# Altium project itanya_lata.PrjPcb
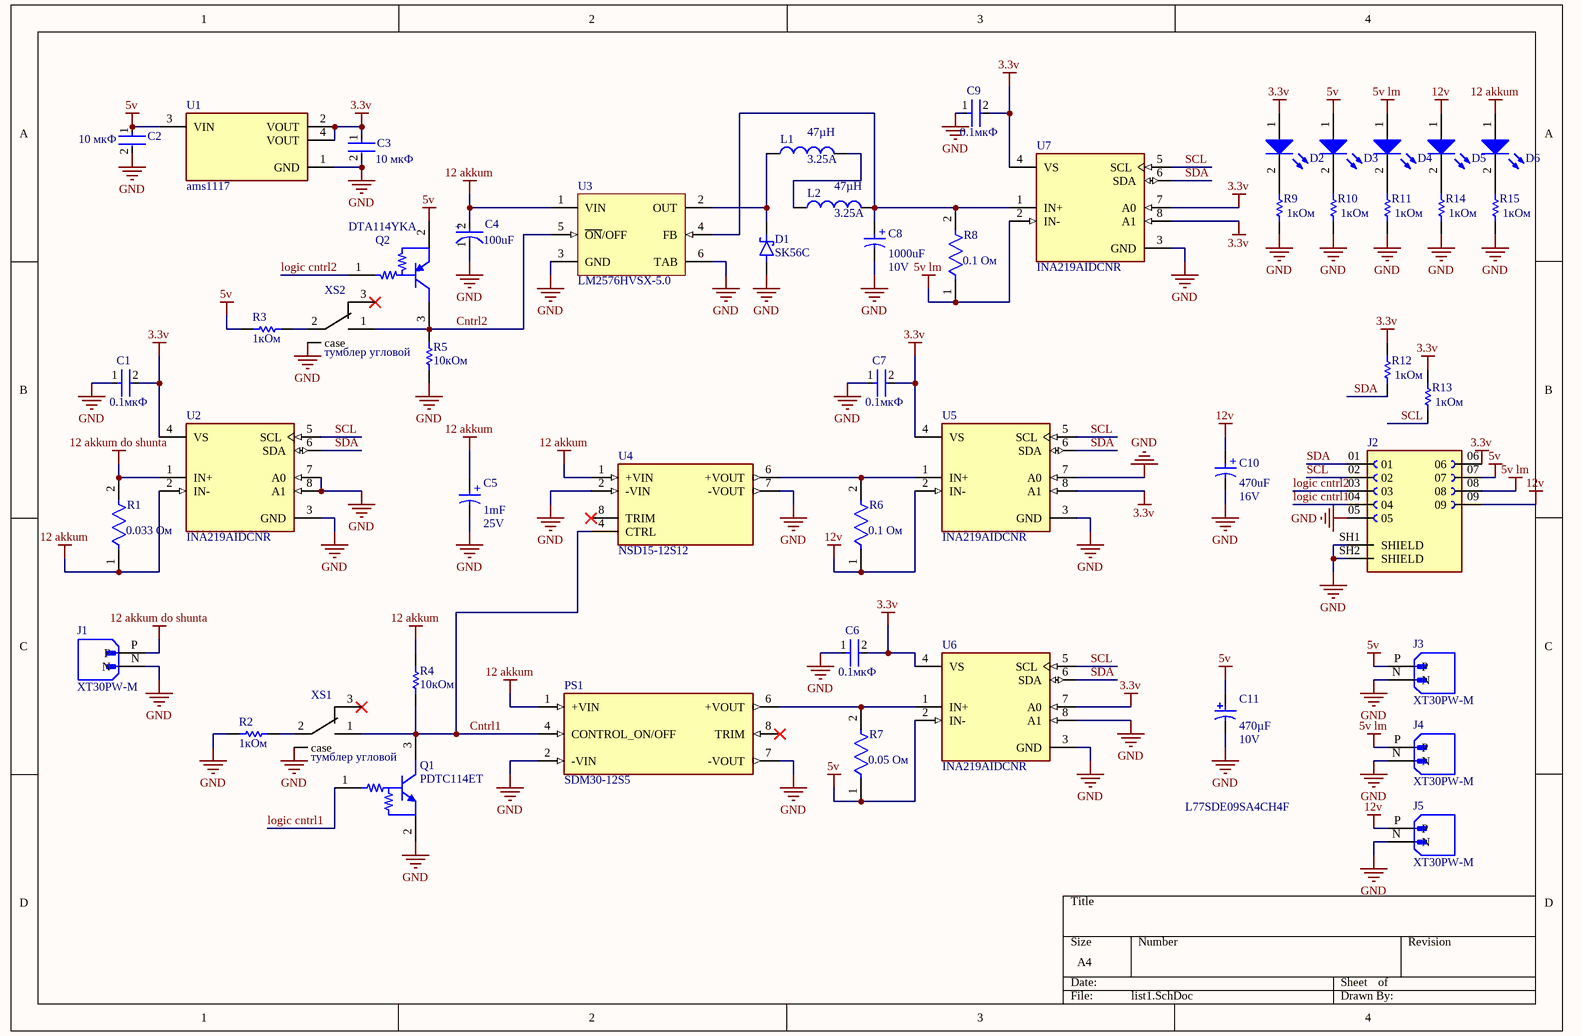
[diagram p0: list1.SchDoc]
2 sheets, 114 parts. Net scope: global (net labels, ports and power ports of the same name join across sheets).
Board files: platka.PcbDoc, PCB1.PcbDoc
Sheets:
  list1.SchDoc
  Main.SchDoc

## Sheet list1.SchDoc
size A4; SheetNumber: 1; SheetTotal: 2

### Parts
(Parts that share a designator on the sheet are numbered #1, #2 ... from top to bottom, then left to right.)
C1#1  value 0.1мкФ  [FP-C0805C-DN-IPC_A]  (hidden comment: C0805C104K5RACTU)
C2#1  value 10 мкФ  [FP-C0805C-DN-IPC_A]  (hidden comment: C0805C104K5RACTU)
C3#1  value 10 мкФ  [FP-C0805C-DN-IPC_A]  (hidden comment: C0805C104K5RACTU)
C4#1  Capacitance: 100uF  [FP-T495D107K016ATE125-MFG]  (hidden comment: T495D107K016ATE125)
C5#1  Voltage Rating: 25V  Capacitance: 1mF  [10*12.5]  (hidden comment: 865060257010)
C6#1  value 0.1мкФ  [FP-C0805C-DN-IPC_A]  (hidden comment: C0805C104K5RACTU)
C7#1  value 0.1мкФ  [FP-C0805C-DN-IPC_A]  (hidden comment: C0805C104K5RACTU)
C8  Voltage Rating: 10V  Capacitance: 1000uF  [WCAP-ASLL_D10H10.5]  (hidden comment: 865060257010)
C9  value 0.1мкФ  [FP-C0805C-DN-IPC_A]  (hidden comment: C0805C104K5RACTU)
C10  Voltage Rating: 16V  Capacitance: 470uF  [WCAP-ASLL_D10H10.5]  (hidden comment: 865060257010)
C11  Capacitance: 470µF  Rated Voltage: 10V  [PNSC-FK-V-F_V]  (hidden comment: EEEFK1C471P)
D1#1  SK56C  [DIOM6859X262N]
D2#1  Infrared, 1.5V, 30°  [WL-TIRC_3mm]  (value not drawn)
D3#1  Infrared, 1.5V, 30°  [WL-TIRC_3mm]  (value not drawn)
D4#1  Infrared, 1.5V, 30°  [WL-TIRC_3mm]  (value not drawn)
D5  Infrared, 1.5V, 30°  [WL-TIRC_3mm]  (value not drawn)
D6  Infrared, 1.5V, 30°  [WL-TIRC_3mm]  (value not drawn)
J1#1  XT30PW-M  [AMASS_XT30PW-M]
J2#1  L77SDE09SA4CH4F  [AMPHENOL_L77SDE09SA4CH4F]
J3  XT30PW-M  [AMASS_XT30PW-M]
J4  XT30PW-M  [AMASS_XT30PW-M]
J5  XT30PW-M  [AMASS_XT30PW-M]
L1  Current Rating: 3.25A  Inductance: 47µH  [SUMI-CDRH127_V]  (hidden comment: CDRH127/LDNP-470MC)
L2  Current Rating: 3.25A  Inductance: 47µH  [SUMI-CDRH127_V]  (hidden comment: CDRH127/LDNP-470MC)
PS1  SDM30-12S5  [CONV_SDM30-12S5]
Q1  PDTC114ET  [ONSC-SC-59-3-318D-04_V]
Q2  DTA114YKA  [ONSC-SOT-23-3-318-08_V]
R1#1  Resistance: 0.033 Ом  [FP-CRCW2512-e3-IPC_A]  (hidden comment: CRCW25121R00FKEG)
R2#1  Package Quantity: 1кОм  [RESC2013X70X40ML20T20]  (hidden comment: ERJ-6ENF1001V)
R3#1  Package Quantity: 1кОм  [RESC2013X70X40ML20T20]  (hidden comment: ERJ-6ENF1001V)
R4#1  Package Quantity: 10кОм  [RESC2013X70X40ML20T20]  (hidden comment: ERJ-6ENF1001V)
R5#1  Package Quantity: 10кОм  [RESC2013X70X40ML20T20]  (hidden comment: ERJ-6ENF1001V)
R6#1  Resistance: 0.1 Ом  [FP-CRCW2512-e3-IPC_A]  (hidden comment: CRCW25121R00FKEG)
R7#1  Resistance: 0.05 Ом  [FP-CRCW2512-e3-IPC_A]  (hidden comment: CRCW25121R00FKEG)
R8#1  Resistance: 0.1 Ом  [FP-CRCW2512-e3-IPC_A]  (hidden comment: CRCW25121R00FKEG)
R9#1  Package Quantity: 1кОм  [RESC2013X70X40ML20T20]  (hidden comment: ERJ-6ENF1001V)
R10#1  Package Quantity: 1кОм  [RESC2013X70X40ML20T20]  (hidden comment: ERJ-6ENF1001V)
R11#1  Package Quantity: 1кОм  [RESC2013X70X40ML20T20]  (hidden comment: ERJ-6ENF1001V)
R12#1  Package Quantity: 1кОм  [RESC2013X70X40ML20T20]  (hidden comment: ERJ-6ENF1001V)
R13#1  Package Quantity: 1кОм  [RESC2013X70X40ML20T20]  (hidden comment: ERJ-6ENF1001V)
R14#1  Package Quantity: 1кОм  [RESC2013X70X40ML20T20]  (hidden comment: ERJ-6ENF1001V)
R15#1  Package Quantity: 1кОм  [RESC2013X70X40ML20T20]  (hidden comment: ERJ-6ENF1001V)
U1#1  ams1117  [FP-ams1117-IPC_A]
U2#1  INA219AIDCNR  [FP-DCN0008A-IPC_C]
U3#1  LM2576HVSX-5.0  [KTT0005B_M]
U4#1  NSD15-12S12  [CONV_NSD15-12S5]
U5#1  INA219AIDCNR  [FP-DCN0008A-IPC_C]
U6  INA219AIDCNR  [FP-DCN0008A-IPC_C]
U7  INA219AIDCNR  [FP-DCN0008A-IPC_C]
XS1  тумблер угловой  [тумблер угловой]
XS2  тумблер угловой  [тумблер угловой]

### Nets
3.3v: C1#1.2 C3#1.1 C6#1.2 C7#1.2 C9.2 D2#1.1(A) J2#1.06 R12#1.2 R13#1.2 U1#1.2(VOUT) U1#1.4(VOUT) U2#1.4(VS) U5#1.4(VS) U5#1.8(A1) U6.4(VS) U6.7(A0) U7.4(VS) U7.7(A0) U7.8(A1)
5v: C2#1.1 C11.1 D3#1.1(A) J2#1.07 J3.P Q2.2(E) R3#1.2 R7#1.1 U1#1.3(VIN) U6.2(IN-)
5v lm: D4#1.1(A) J2#1.08 J4.P R8#1.1 U7.2(IN-)
12 akkum: C4#1.2(A) C5#1.1(P) D6.1(A) PS1.1(+VIN) R1#1.1 R4#1.1 U2#1.2(IN-) U3#1.1(VIN) U4#1.1(+VIN)
12 akkum do shunta: J1#1.P R1#1.2 U2#1.1(IN+)
12v: C10.1(P) D5.1(A) J2#1.09 J5.P R6#1.1 U5#1.2(IN-)
GND: C1#1.1 C2#1.2 C3#1.2 C4#1.1(C) C5#1.2(N) C6#1.1 C7#1.1 C8.2(N) C9.1 C10.2(N) C11.2 D1#1.A J1#1.N J2#1.05 J2#1.SH1(SHIELD) J2#1.SH2(SHIELD) J3.N J4.N J5.N PS1.2(-VIN) PS1.7(-VOUT) Q1.2(E) R2#1.2 R5#1.1 R9#1.1 R10#1.1 R11#1.1 R14#1.1 R15#1.1 U1#1.1(GND) U2#1.3(GND) U2#1.7(A0) U2#1.8(A1) U3#1.3(GND) U3#1.6(TAB) U4#1.2(-VIN) U4#1.7(-VOUT) U5#1.3(GND) U5#1.7(A0) U6.3(GND) U6.8(A1) U7.3(GND) XS1.0(case) XS2.0(case)
Cntrl1: PS1.4(CONTROL_ON/OFF) Q1.3(C) R4#1.2 U4#1.4(CTRL) XS1.1
Cntrl2: Q2.3(C) R5#1.2 U3#1.5(~{ON}/OFF) XS2.1
logic cntrl1: J2#1.04 Q1.1(B)
logic cntrl2: J2#1.03 Q2.1(B)
SCL: J2#1.02 R13#1.1 U2#1.5(SCL) U5#1.5(SCL) U6.5(SCL) U7.5(SCL)
SDA: J2#1.01 R12#1.1 U2#1.6(SDA) U5#1.6(SDA) U6.6(SDA) U7.6(SDA)
NetC8_1: C8.1(P) L2.2 R8#1.2 U3#1.4(FB) U7.1(IN+)
NetD1#1_C: D1#1.C(K) L1.1 U3#1.2(OUT)
NetD2#1_2: D2#1.2(K) R9#1.2
NetD3#1_2: D3#1.2(K) R10#1.2
NetD4#1_2: D4#1.2(K) R11#1.2
NetD5_2: D5.2(K) R14#1.2
NetD6_2: D6.2(K) R15#1.2
NetL1_2: L1.2 L2.1
NetPS1_6: PS1.6(+VOUT) R7#1.2 U6.1(IN+)
NetR2#1_1: R2#1.1 XS1.2
NetR3#1_1: R3#1.1 XS2.2
NetR6#1_2: R6#1.2 U4#1.6(+VOUT) U5#1.1(IN+)

Not connected (* = marked no-connect by the designer): PS1 8(TRIM)*; U4#1 8(TRIM)*; XS1 3*; XS2 3*

### Notes on the sheet
- (in symbol CMP-2000-07207-2) +
- (in symbol CMP-03913-54202466-2) +
- (in symbol konder) +

### Library data of the parts
C1#1 C6#1 C7#1 C9 = CMP-2007-00279-2: CAP CER 0.1UF 50V X7R 0805; Manufacturer: KEMET; Tolerance: 0.1; Temperature Coefficient: 30ppm/°C; Material: Ceramic; Capacitance: 0.10 μF; Manufacturer Part Number: C0805C104K5RACTU; Device Class L2: Capacitors; Temperature Range Low: -55°C; Voltage Rating: 50 V; Digikey Description: CAP CER 0.1UF 50V X7R 0805; Category: Cap; ComponentLink2Description: Datasheet; Octopart: https://octopart.com/c0805c104k5ractu-kemet-143926; RoHS: TRUE; ComponentLink2URL: https://content.kemet.com/datasheets/KEM_C1003_C0G_SMD.pdf; Temperature Characteristic: X7R; Temperature: -55°C to +125°C; Height: 0.88mm; Temperature Range High: +125°C; Device Class L1: Passive Components; Automotive: No; Lead Free: Yes; Ipc Land Pattern Name: CAPC200125X78; Device Class L3: Ceramic Capacitors; Mouser Description: Cap Ceramic 0.1uF 50V X7R 10% SMD 2.0 x 1.2 mm 125 C Paper T/R; Package: C0805C-DN
C2#1 C3#1 = CMP-2007-00279-2: CAP CER 10UF 50V X7R 0805; Manufacturer: KEMET; Tolerance: 0.1; Temperature Coefficient: 30ppm/°C; Material: Ceramic; Capacitance: 0.10 μF; Manufacturer Part Number: C0805C104K5RACTU; Device Class L2: Capacitors; Temperature Range Low: -55°C; Voltage Rating: 50 V; Digikey Description: CAP CER 0.1UF 50V X7R 0805; Category: Cap; ComponentLink2Description: Datasheet; Octopart: https://octopart.com/c0805c104k5ractu-kemet-143926; RoHS: TRUE; ComponentLink2URL: https://content.kemet.com/datasheets/KEM_C1003_C0G_SMD.pdf; Temperature Characteristic: X7R; Temperature: -55°C to +125°C; Height: 0.88mm; Temperature Range High: +125°C; Device Class L1: Passive Components; Automotive: No; Lead Free: Yes; Ipc Land Pattern Name: CAPC200125X78; Device Class L3: Ceramic Capacitors; Mouser Description: Cap Ceramic 0.1uF 50V X7R 10% SMD 2.0 x 1.2 mm 125 C Paper T/R; Package: C0805C-DN
C4#1 = CMP-2000-07207-2: CAP TANT 100UF 10% 16V 2917; Life (Hours): 2000Hour; ESR (Equivalent Series Resistance): 125mR; Polarity: Polar; Dielectric Material: Tantalum; Dissipation Factor: 8%; Radiation Hardening: No; RoHS Compliant: Yes; Length: 7.3mm; Features: General Purpose; Packaging: Tape and Reel; Package Quantity: 1; Weight: 0.023634oz; Voltage Rating: 16V; Width: 0.169inch; Case/Package: 2917; Mount: Surface Mount; Voltage: 16V; Min Operating Temperature: -55°C; Tolerance: 10%; REACH SVHC: No SVHC; Height - Seated (Max): 0.122inch; Number of Pins: 2; Construction: Flat; Depth: 4.3mm; Series: T495; Max Operating Temperature: 125°C; Failure Rate: 0.001%; Termination: SMD/SMT; Voltage Rating (DC): 16V; Case Code (Imperial): 2917; Case Code (Metric): 7343; Height: 2.8mm
C5#1 = konder: 865060257010 WCAP-ASLL Aluminum Electrolytic Capacitors 1000uf 25V; NexarPartId: 54202466; ESR (Equivalent Series Resistance): 99.9268mΩ; Insulation Resistance: 100kΩ; Voltage Rating (DC): 10V; Life (Hours): 5000hours; Ripple Current: 690mA; Impedance: 90mΩ; Polarity: Polar; Leakage Current: 100µA; Tolerance: 20%; Diameter: 10mm; Min Operating Temperature: -55°C; Max Operating Temperature: 105°C; Length: 12.5mm; Height: 10.5mm; Height - Seated (Max): 10.4902mm; Mount: Surface Mount; Case/Package: Radial; REACH SVHC: Unknown; Ripple Current (AC): 690mA; RoHS: Compliant
C8 = CMP-03913-54202466-2: 865060257010 WCAP-ASLL Aluminum Electrolytic Capacitors 1000uf 10v; ESR (Equivalent Series Resistance): 99.9268mΩ; Insulation Resistance: 100kΩ; Life (Hours): 5000hours; Ripple Current: 690mA; Impedance: 90mΩ; Polarity: Polar; Leakage Current: 100µA; Tolerance: 20%; Diameter: 10mm; Min Operating Temperature: -55°C; Max Operating Temperature: 105°C; Length: 10.5mm; Voltage Rating (DC): 10V; Height: 10.5mm; Height - Seated (Max): 10.4902mm; Mount: Surface Mount; Case/Package: Radial; REACH SVHC: Unknown; NexarPartId: 54202466; Ripple Current (AC): 690mA; RoHS: Compliant
C10 = CMP-03913-54202466-2: 865060257010 WCAP-ASLL Aluminum Electrolytic Capacitors 470uf 16v; ESR (Equivalent Series Resistance): 99.9268mΩ; Insulation Resistance: 100kΩ; Voltage Rating (DC): 10V; Life (Hours): 5000hours; Ripple Current: 690mA; Impedance: 90mΩ; Polarity: Polar; Leakage Current: 100µA; Tolerance: 20%; Diameter: 10mm; Min Operating Temperature: -55°C; Max Operating Temperature: 105°C; Length: 10.5mm; Height: 10.5mm; Height - Seated (Max): 10.4902mm; Mount: Surface Mount; Case/Package: Radial; REACH SVHC: Unknown; NexarPartId: 54202466; Ripple Current (AC): 690mA; RoHS: Compliant
C11 = CMP-2000-06204-1: Aluminum Electrolytic Capacitor, 470 uF, +/- 20%, 10 V, 2-Pin SMD (Size Code F), -55 to 105 degC, RoHS, Tape and Reel; Manufacturer: Panasonic; Type: Can; Ripple Current: 600mA; Lifetime@Temperature: 2000Hrs@105°C; Impedance: 0.16O; Manufacturer URL: http://www.panasonic.com/; Package Description: 2-Pin Electrolytic Aluminum Capacitor, Body 8.3 x 8.3 mm; Operating Temp-Max: 105°C; Mounting Technology: SurfaceMount; Operating Temp Range: -55to+105°C; Datasheet Version: 03/2016; Series: FK; Package Reference: FK-V-F; Case Size/Dimension: Ø8x10.2mm; Package URL: http://industrial.panasonic.com/cdbs/www-data/pdf/RDE0000/DME0000COL48.pdf; Datasheet URL: http://industrial.panasonic.com/cdbs/www-data/pdf/RDE0000/ABA0000C1181.pdf
D1#1 = SK56C: 5A, 60V, Schottky Rectifier; MF: Taiwan Semiconductor; Purchase-URL: https://pricing.snapeda.com/search/part/SK56C/?ref=eda; Package: SMC-2 Taiwan Semiconductor; Availability: In Stock; Value: *; MP: SK56C; Check_prices: https://www.snapeda.com/parts/SK56C/Taiwan+Semiconductor/view-part/?ref=eda; Price: None; SnapEDA_Link: https://www.snapeda.com/parts/SK56C/Taiwan+Semiconductor/view-part/?ref=snap
D2#1 D3#1 D4#1 D5 D6 = 15400385F3590: WL-TIRC THT Infrared Round Waterclear, 3mm, 60mW/sr, Infrared, 1.5V, 30°; Manufacturer: Wurth Elektronik; Centroid Wavelength: 845nm; Chip Technology: AlGaAs; Manufacturer Part Number: 15400385F3590; Category: Infrared LEDs; Match Code: WL-TIRC; ComponentLink1Description: Website Link; ComponentLink1URL: https://www.we-online.com/redexpert/article/15400385F3590?ad; ComponentLink2Description: Datasheet Link; ComponentLink2URL: https://www.we-online.com/redexpert/spec/15400385F3590?ad; Mount: Through Hole; Operating Temperature Max: 85°C; Operating Temperature Min: -40°C; Packaging: Bulk; Height: 5.3mm; Diameter: 3.85mm; Emitting Color: Infrared; Forward Voltage: 1.5V; Radiant Intensity: 60mW/sr; Viewing Angle: 30°
J1#1 J3-J5 = XT30PW-M: Socket; DC supply; XT30; male; PIN: 2; on PCBs; THT; Colour: yellow; MF: AMASS; SnapEDA_Link: https://www.snapeda.com/parts/XT30PW-M/AMASS/view-part/?ref=snap; Package: None; Value: *; MP: XT30PW-M; Check_prices: https://www.snapeda.com/parts/XT30PW-M/AMASS/view-part/?ref=eda
J2#1 = L77SDE09SA4CH4F: Connector d-sub rt angle pcb recept 4-40 threaded hole w/screwlock 9 socket cont | Amphenol Commercial (Amphenol CS) L77SDE09SA4CH4F; MF: Amphenol ICC (Commercial Products); SnapEDA_Link: https://www.snapeda.com/parts/L77SDE09SA4CH4F/Amphenol/view-part/?ref=snap; Package: None; Value: *; MP: L77SDE09SA4CH4F; Check_prices: https://www.snapeda.com/parts/L77SDE09SA4CH4F/Amphenol/view-part/?ref=eda
L1 L2 = CMP-2000-06084-1: Power Inductor, 10 uH, +/- 20%, -40 to 100 degC, 2-Pin SMD, RoHS, Tape and Reel; Manufacturer: Sumida; Catalog Drawings: CDRH127SeriesFrontCDRH127SeriesSideCDRH127SeriesBottom; Product Training Modules: PowerInductorBasics; Shielding: Shielded; Online Catalog: CDRHSeries; DC Resistance (DCR): 21.6mOhmMax; Other Names: 308-1457-1; Frequency - Test: 1kHz; Mounting Type: SurfaceMount; Datasheet Version: 01/2014; Package Description: 2-Pin Surface Mount Device, Body 12 x 12 mm; Frequency - Self Resonant: -; Package Reference: CDRH127; Category: Inductors,Coils,Chokes; Material - Core: -; Q @ Freq: -; Type: -; Family: FixedInductors; Ratings: -; Series: CDRH127; Manufacturer URL: http://www.sumida.com/; Operating Temperature: -40°C~100°C; Height - Seated (Max): 0.315"(8.00mm); Standard Package: 1; Size / Dimension: 0.472"Lx0.472"W(12.00mmx12.00mm); Current - Saturation: -; Datasheet URL: http://products.sumida.com/products/pdf/CDRH127.pdf; Package / Case: Nonstandard; Tolerance: ±20%; Mounting Technology: SurfaceMount; Packaging: CutTape(CT)
PS1 = SDM30-12S5: Isolated Module DC DC Converter 1 Output 5V 5A 9.2V - 18V Input; MF: MEAN WELL; Value: *; SnapEDA_Link: https://www.snapeda.com/parts/SDM30-12S5/MEAN%20WELL%20USA%20Inc./view-part/9848/?ref=snap; MP: SDM30-12S5; Check_prices: https://www.snapeda.com/parts/SDM30-12S5/MEAN%20WELL%20USA%20Inc./view-part/9848/?ref=eda; Package: DIP-8 Mean Well; Digi-Key_Part_Number: 1866-4448-ND; Purchase-URL: https://pricing.snapeda.com/search/part/SDM30-12S5/?ref=eda
Q1 = CMP-0630-00125-1: Digital Transistor (BRT), R1=47 kOhm, R2=47 kOhm, NPN Transistor, 3-Pin SC-59, Pb-Free, Tape and Reel пох какой цифровой транзюк; Manufacturer: On Semiconductor; PartNumber: MUN2213T1G; V(BR)CEO Min (V): 50; IC Continuous (A): 0.1; R1/R2 Typ: 1; hFE Min: 80; ComponentLink1URL: http://www.onsemi.com/; ComponentLink3URL: http://www.onsemi.cn/pub_link/Collateral/318D-04.PDF; ComponentLink2Description: Datasheet; RoHS: TRUE; Mounting Technology: Surface Mount; PackageReference: SC-59-3-318D-04; PackageVersion: Rev. H, 06/2012; DatasheetVersion: Rev. 2; Polarity: NPN; ComponentLink2URL: http://www.onsemi.cn/pub_link/Collateral/DTC144E-D.PDF; ComponentLink1Description: Manufacturer URL; Packing: Tape and Reel; PackageDescription: 3-Pin Small Outline Transistor, Body 2.9 x 1.5 mm, Pitch 0.95 mm; ComponentLink3Description: Package Specification
Q2 = CMP-0630-00280-1: Digital Transistor (BRT), R1=4.7 kOhm, R2=infinity kOhm, PNP Transistor, 3-Pin SOT-23, Pb-Free, Tape and Reel; PartNumber: SMMUN2116LT3G; Manufacturer: On Semiconductor; hFE Min: 160; IC Continuous (A): 0.1; V(BR)CEO Min (V): 50; ComponentLink3Description: Package Specification; PackageDescription: 3-Pin Small Outline Transistor, Body 2.92 x 1.3 mm, Pitch 0.95 mm; PackageReference: SOT-23-3-318-08; ComponentLink1URL: http://www.onsemi.com/; ComponentLink3URL: http://www.onsemi.cn/pub_link/Collateral/318-08.PDF; Polarity: PNP; Packing: Tape and Reel; RoHS: TRUE; DatasheetVersion: Rev. 2; Mounting Technology: Surface Mount; ComponentLink2URL: http://www.onsemi.cn/pub_link/Collateral/DTA143T-D.PDF; PackageVersion: Rev. AP, 11/2009; ComponentLink2Description: Datasheet; ComponentLink1Description: Manufacturer URL
R1#1 R6#1 R7#1 R8#1 = CMP-02407-006956-1: RES Thick Film, 1Ω, 1%, 1W, 100ppm/°C, 2512; Voltage Rating: 500V; Number of Terminations: 2; Packaging: Tape and Reel; Features: Automotive AEC-Q200; Military Standard: Not; Power Rating: 1W; Max Operating Temperature: 155°C; Number of Pins: 2; Radiation Hardening: No; Mount: Surface Mount; Height: 0.6mm; Max Power Dissipation: 1W; Case Code (Metric): 6432; Termination: SMD/SMT; REACH SVHC: No SVHC; Case/Package: 2512; Weight: 0.001429oz; Tolerance: 1%; Package Quantity: 2000; Composition: Thick Film; Temperature Coefficient: 100ppm/°C; Voltage Rating (DC): 500V; Width: 0.124inch; Length: 6.3mm; Lead Free: Lead Free; Min Operating Temperature: -55°C; Contact Plating: Tin; Case Code (Imperial): 2512; Depth: 3.15mm
R2#1 R3#1 R4#1 R5#1 R9#1 R10#1 R11#1 R12#1 R13#1 R14#1 R15#1 = CMP-2001-04375-5: Chip Resistor, 1 KOhm, +/- 1%, 0.125 W, -55 to 155 degC, 0805 (2012 Metric), RoHS, Tape and Reel; Manufacturer: Panasonic; Voltage Rating: 150 V; ComponentLink1URL: http://www.panasonic.com/; ComponentLink2Description: Datasheet; REACH SVHC: Yes; ComponentLink1Description: Manufacturer URL; Length: 2 mm; Height: 0.6 mm; PackageDescription: 2-Pin Surface Mount Device, Body 2 x 1.25 mm; Packaging: Cut Tape; PackageReference: 0805; Max Operating Temperature: 155 degC; Mounting Technology: Surface Mount; ComponentLink2URL: http://industrial.panasonic.com/cdbs/www-data/pdf/RDA0000/AOA0000C86.pdf; DatasheetVersion: 04/2015; Min Operating Temperature: -55 degC; RoHSCompliant: true; Mount: Surface Mount
U1#1 = CMP-209535-000002-1: 1A LOW DROPOUT VOLTAGE REGULATOR 3.3V; RoHS Compliant: Yes
U2#1 U5#1 U6 U7 = CMP-0704-00041-3: IC CURRENT MONITOR 1% SOT23-8; Common Mode Rejection Ratio: 100dB; Bandwidth: 3.4MHz; Operating Supply Current: 1mA; Nominal Supply Current: 700uA; Min Input Voltage: 0V; Output Current per Channel: 10mA; Number of Amplifiers: 1; Input Offset Voltage (Vos): 100uV; Max Input Voltage: 26V; Min Supply Voltage: 3V; Max Supply Current: 5mA; Max Supply Voltage: 5.5V; Output Type: Digital; Accuracy: 1%; Radiation Hardening: No; Min Operating Temperature: -40°C; Contact Plating: Gold; REACH SVHC: No SVHC; Packaging: Tape and Reel; Max Operating Temperature: 125°C; Lead Free: Lead Free; Weight: 0.001411oz; Supply Current: 700uA; Number of Pins: 8; Length: 3mm; Quiescent Current: 700uA; Features: I²C; Height: 1.3mm; Output Current: 10mA; Case/Package: SOT-23-8; RoHS Compliant: Yes; Width: 1.75mm; Package Quantity: 3000; Series: Zero-Drift
U3#1 = CMP-0069-00141-3: SIMPLE SWITCHER® 3A Step-Down Voltage Regulator, 5-pin TO-263; Manufacturer: Texas Instruments; PackageTopMarking: NSUZXYTTE#*LM2576*HVS-5.0 P+; PowerWise: N; RoHS: N; PackageDescription: TO-263, Molded, .400 x .390 x .180in, 5 Lead, .067in Pitch, Surface Mount; Code_JEDEC: MO-169-AB; CompType: Switcher; ComponentLink1URL: http://www.ti.com/general/docs/lit/getliterature.tsp?genericPartNumber=LM2576HV&fileType=pdf; ComponentLink1Description: Datasheet URL; PinCount: 5; PackageReference: KTT0005B
U4#1 = NSD15-12S12: Isolated Module DC DC Converter 1 Output 5V 3A 9.4V - 36V Input; MP: NSD15-12S5; MF: MEAN WELL; SnapEDA_Link: https://www.snapeda.com/parts/NSD15-12S5/MEAN%20WELL%20USA%20Inc./view-part/356097/?ref=snap; Value: *; Package: DIP-8 Mean Well; Digi-Key_Part_Number: 1866-3633-ND
XS1 XS2 = тумблер угловой: SMTS-102-2C4

## Sheet Main.SchDoc
size A2; SheetNumber: 2; SheetTotal: 2
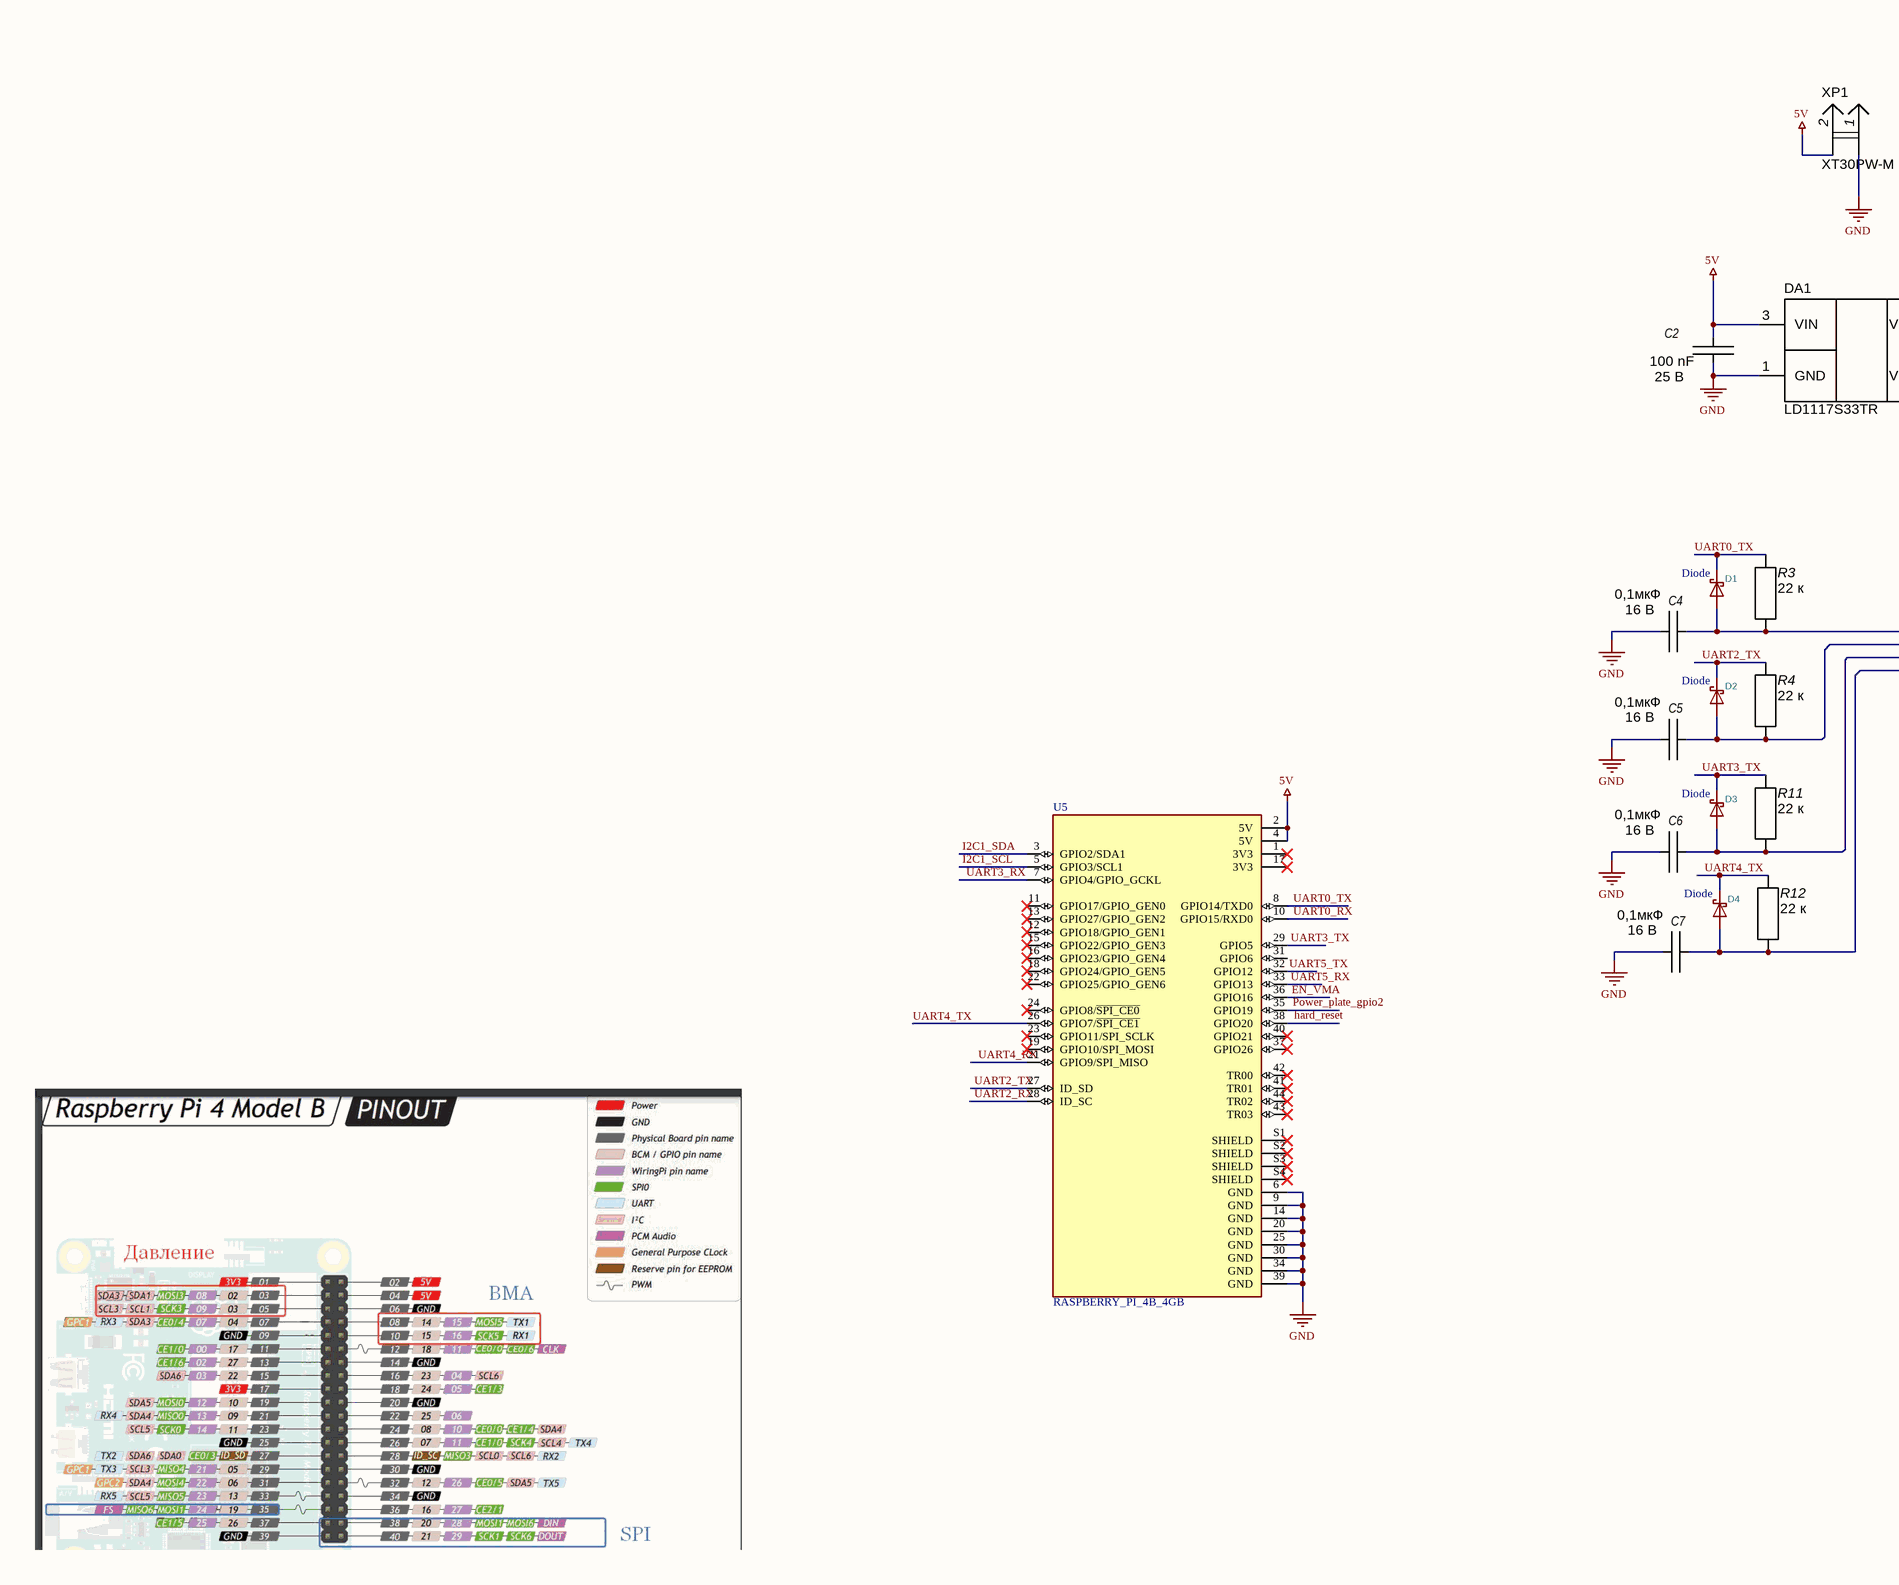
[diagram p1: Main.SchDoc, left]
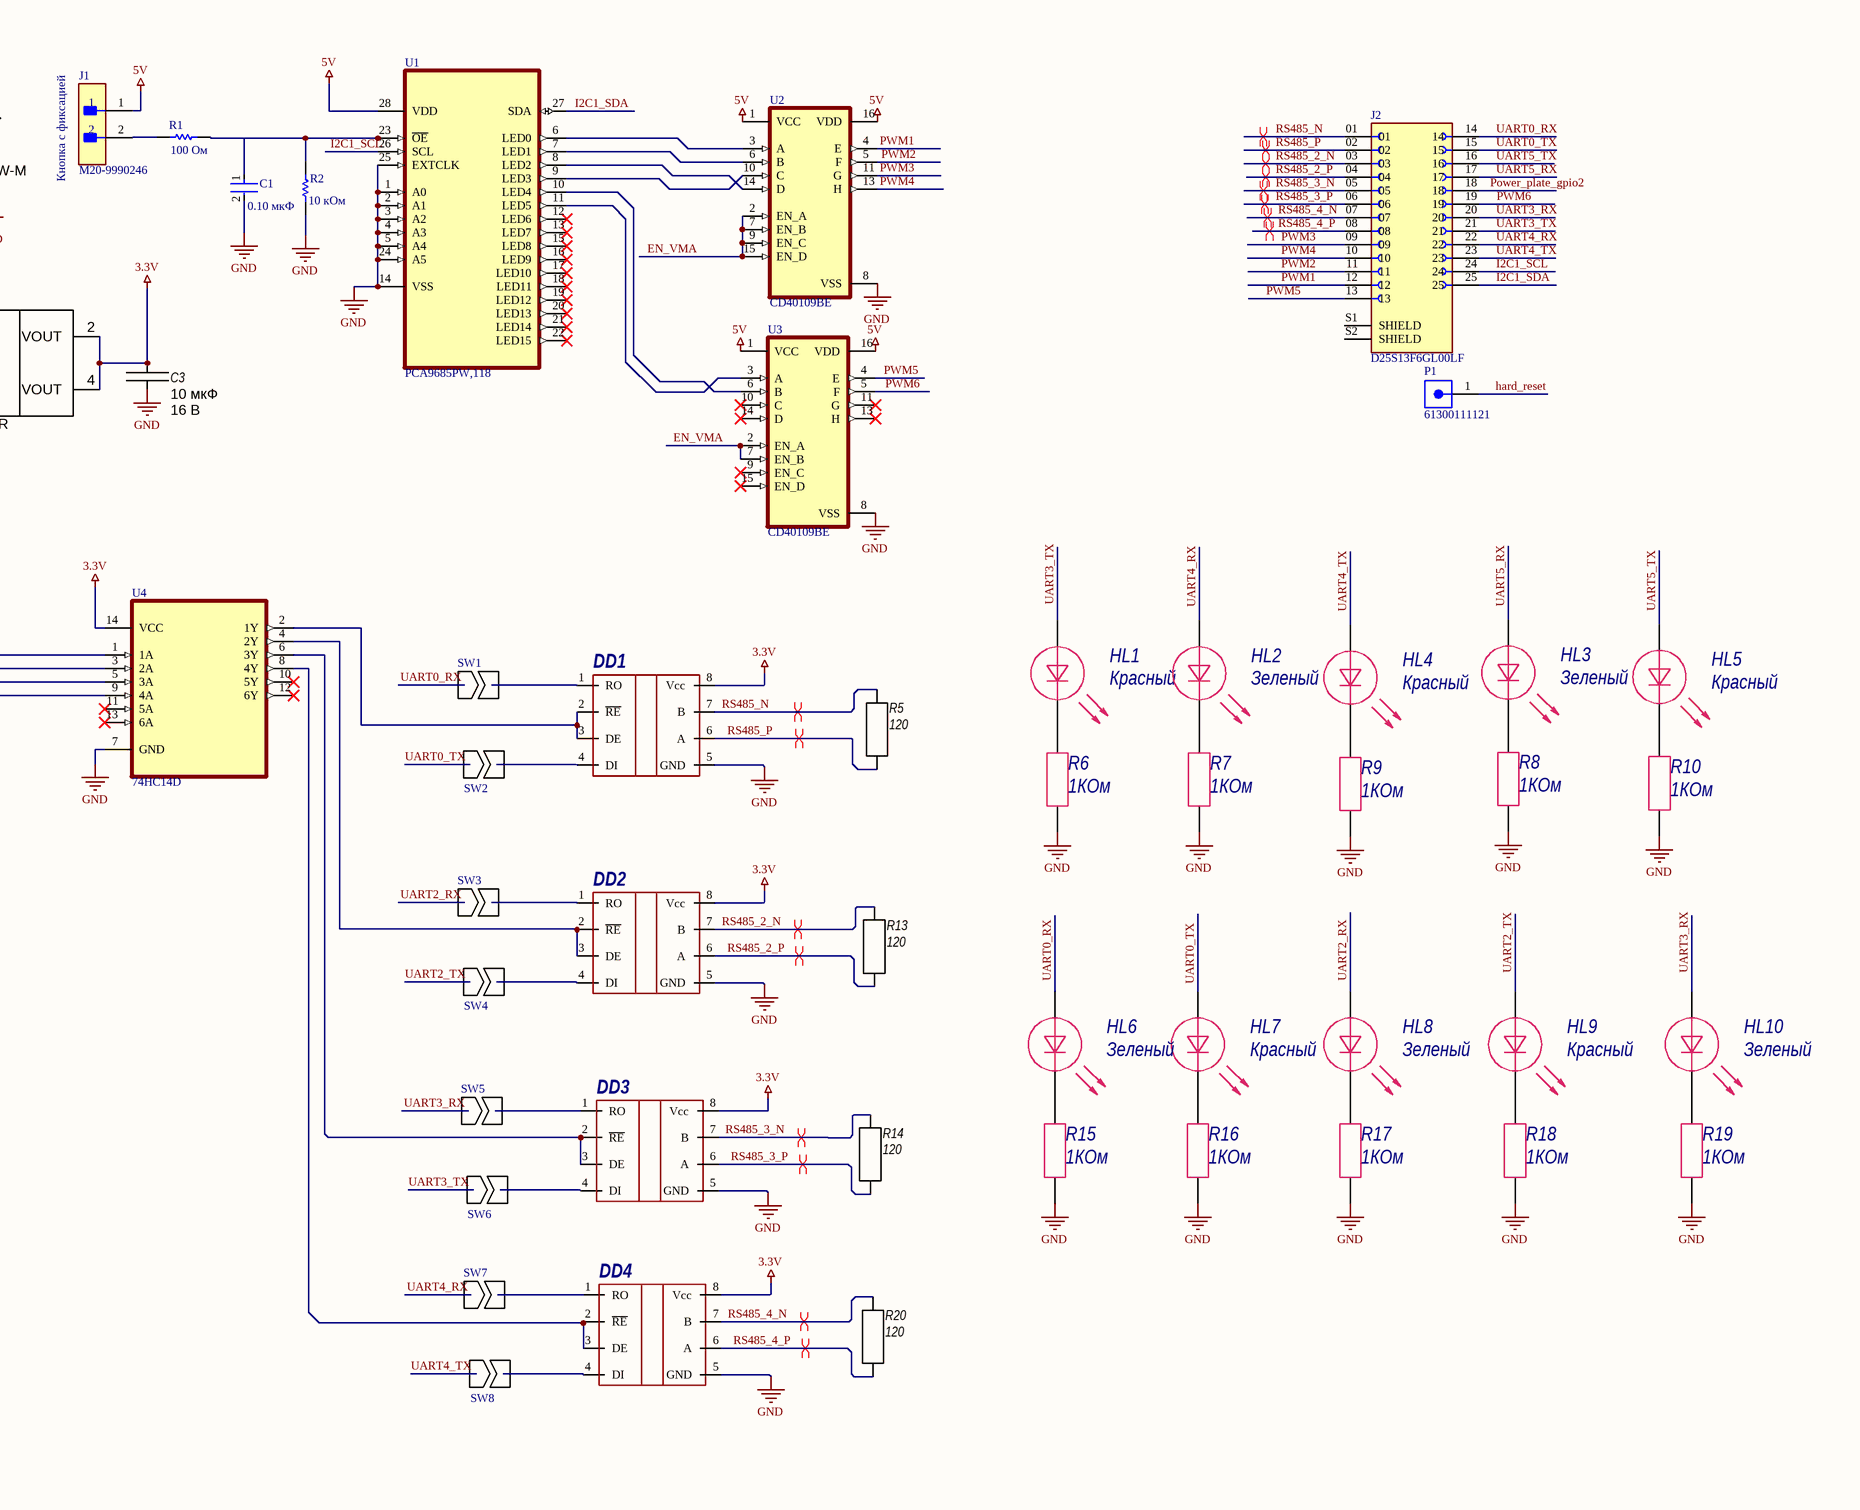
[diagram p2: Main.SchDoc, right]

### Parts
(Parts that share a designator on the sheet are numbered #1, #2 ... from top to bottom, then left to right.)
C1#2  value 0.10 мкФ  [FP-C0805C-DN-IPC_A]  (hidden comment: C0805C104K5RACTU)
C2#2  Voltage: 25 В  [C0402C]  (hidden comment: 100 nF)
C3#2  Voltage: 16 В  [C0805C]  (hidden comment: 10 мкФ)
C4#2  Voltage: 16 В  [C0603C]  (hidden comment: 0,1мкФ)
C5#2  Voltage: 16 В  [C0603C]  (hidden comment: 0,1мкФ)
C6#2  Voltage: 16 В  [C0603C]  (hidden comment: 0,1мкФ)
C7#2  Voltage: 16 В  [C0603C]  (hidden comment: 0,1мкФ)
D1#2  Diode  [SOD-123F]
D2#2  Diode  [SOD-123F]
D3#2  Diode  [SOD-123F]
D4#2  Diode  [SOD-123F]
DA1  LD1117S33TR  [SOT-223]
DD1  (no value)  [SOIC8N]
DD2  (no value)  [SOIC8N]
DD3  (no value)  [SOIC8N]
DD4  (no value)  [SOIC8N]
HL1  Color: Красный  [0805D]
HL2  Color: Зеленый  [0805D]
HL3  Color: Зеленый  [0805D]
HL4  Color: Красный  [0805D]
HL5  Color: Красный  [0805D]
HL6  Color: Зеленый  [0805D]
HL7  Color: Красный  [0805D]
HL8  Color: Зеленый  [0805D]
HL9  Color: Красный  [0805D]
HL10  Color: Зеленый  [0805D]
J1#2  M20-9990246  [FP-M20-9990246-MFG]
J2#2  D25S13F6GL00LF  [AMPHENOL_D25S13F6GL00LF]
P1  61300111121  [61300111121]
R1#2  value 100 Ом  [RESC2013X70X40ML20T20]  (hidden comment: ERJ-6ENF1001V)
R2#2  value 10 кОм  [RESC2013X70X40ML20T20]  (hidden comment: ERJ-6ENF1001V)
R3#2  22 к  [C0603R]
R4#2  22 к  [C0603R]
R5#2  120  [C0603R]
R6#2  value 1КОм  [0603R]  (hidden comment: Resistor)
R7#2  value 1КОм  [0603R]  (hidden comment: Resistor)
R8#2  value 1КОм  [0603R]  (hidden comment: Resistor)
R9#2  value 1КОм  [0603R]  (hidden comment: Resistor)
R10#2  value 1КОм  [0603R]  (hidden comment: Resistor)
R11#2  22 к  [C0603R]
R12#2  22 к  [C0603R]
R13#2  120  [C0603R]
R14#2  120  [C0603R]
R15#2  value 1КОм  [0603R]  (hidden comment: Resistor)
R16  value 1КОм  [0603R]  (hidden comment: Resistor)
R17  value 1КОм  [0603R]  (hidden comment: Resistor)
R18  value 1КОм  [0603R]  (hidden comment: Resistor)
R19  value 1КОм  [0603R]  (hidden comment: Resistor)
R20  120  [C0603R]
SW1  SW2  [SW2]  (value not drawn)
SW2  SW2  [SW2]  (value not drawn)
SW3  SW2  [SW2]  (value not drawn)
SW4  SW2  [SW2]  (value not drawn)
SW5  SW2  [SW2]  (value not drawn)
SW6  SW2  [SW2]  (value not drawn)
SW7  SW2  [SW2]  (value not drawn)
SW8  SW2  [SW2]  (value not drawn)
U1#2  PCA9685PW,118  [SOP65P640X110-28N]
U2#2  CD40109BE  [DIP794W45P254L1969H508Q16]
U3#2  CD40109BE  [DIP794W45P254L1969H508Q16]
U4#2  74HC14D  [SOIC127P600X175-14N]
U5#2  RASPBERRY_PI_4B_4GB  [MODULE_RASPBERRY_PI_4B_4GB]
XP1  XT30PW-M  [XT30PW-M]

### Nets
3.3v: C3#2.1 DA1.2(VOUT) DA1.4(VOUT) DD1.8(Vcc) DD2.8(Vcc) DD3.8(Vcc) DD4.8(Vcc) U4#2.14(VCC)
5v: C2#2.1 DA1.3(VIN) J1#2.1 U1#2.28(VDD) U2#2.1(VCC) U2#2.16(VDD) U3#2.1(VCC) U3#2.16(VDD) U5#2.2(5V) U5#2.4(5V) XP1.2
GND: C1#2.2 C2#2.2 C3#2.2 C4#2.2 C5#2.2 C6#2.2 C7#2.2 DA1.1(GND) DD1.5(GND) DD2.5(GND) DD3.5(GND) DD4.5(GND) R2#2.1 R6#2.1 R7#2.1 R8#2.1 R9#2.1 R10#2.1 R15#2.1 R16.1 R17.1 R18.1 R19.1 U1#2.1(A0) U1#2.2(A1) U1#2.3(A2) U1#2.4(A3) U1#2.5(A4) U1#2.14(VSS) U1#2.24(A5) U1#2.25(EXTCLK) U2#2.8(VSS) U3#2.8(VSS) U4#2.7(GND) U5#2.6(GND) U5#2.9(GND) U5#2.14(GND) U5#2.20(GND) U5#2.25(GND) U5#2.30(GND) U5#2.34(GND) U5#2.39(GND) XP1.1
EN_VMA: U2#2.2(EN_A) U2#2.7(EN_B) U2#2.9(EN_C) U2#2.15(EN_D) U3#2.2(EN_A) U3#2.7(EN_B) U5#2.36(GPIO16)
hard_reset: P1.1 U5#2.38(GPIO20)
I2C1_SCL: J2#2.24 U1#2.26(SCL) U5#2.5(GPIO3/SCL1)
I2C1_SDA: J2#2.25 U1#2.27(SDA) U5#2.3(GPIO2/SDA1)
Power_plate_gpio2: J2#2.18 U5#2.35(GPIO19)
PWM1: J2#2.12 U2#2.4(E)
PWM2: J2#2.11 U2#2.5(F)
PWM3: J2#2.09 U2#2.11(G)
PWM4: J2#2.10 U2#2.13(H)
PWM5: J2#2.13 U3#2.4(E)
PWM6: J2#2.19 U3#2.5(F)
RS485_2_N: DD2.7(B) J2#2.03 R13#2.1
RS485_2_P: DD2.6(A) J2#2.04 R13#2.2
RS485_3_N: DD3.7(B) J2#2.05 R14#2.1
RS485_3_P: DD3.6(A) J2#2.06 R14#2.2
RS485_4_N: DD4.7(B) J2#2.07 R20.1
RS485_4_P: DD4.6(A) J2#2.08 R20.2
RS485_N: DD1.7(B) J2#2.01 R5#2.1
RS485_P: DD1.6(A) J2#2.02 R5#2.2
UART0_RX: HL6.1 J2#2.14 SW1.1 U5#2.10(GPIO15/RXD0)
UART0_TX: D1#2.K HL7.1 J2#2.15 R3#2.1 SW2.1 U5#2.8(GPIO14/TXD0)
UART2_RX: HL8.1 SW3.1 U5#2.28(ID_SC)
UART2_TX: D2#2.K HL9.1 R4#2.1 SW4.1 U5#2.27(ID_SD)
UART3_RX: HL10.1 J2#2.20 SW5.1 U5#2.7(GPIO4/GPIO_GCKL)
UART3_TX: D3#2.K HL1.1 J2#2.21 R11#2.1 SW6.1 U5#2.29(GPIO5)
UART4_RX: HL2.1 J2#2.22 SW7.1 U5#2.21(GPIO9/SPI_MISO)
UART4_TX: D4#2.K HL4.1 J2#2.23 R12#2.1 SW8.1 U5#2.26(GPIO7/~{SPI_CE1})
UART5_RX: HL3.1 J2#2.17 U5#2.33(GPIO13)
UART5_TX: HL5.1 J2#2.16 U5#2.32(GPIO12)
NetC1#2_1: C1#2.1 R1#2.2 R2#2.2 U1#2.23(~{OE})
NetC4#2_1: C4#2.1 D1#2.A R3#2.2 U4#2.1(1A)
NetC5#2_1: C5#2.1 D2#2.A R4#2.2 U4#2.3(2A)
NetC6#2_1: C6#2.1 D3#2.A R11#2.2 U4#2.5(3A)
NetC7#2_1: C7#2.1 D4#2.A R12#2.2 U4#2.9(4A)
NetDD1_1: DD1.1(RO) SW1.2
NetDD1_2: DD1.2(~{RE}) DD1.3(DE) U4#2.2(1Y)
NetDD1_4: DD1.4(DI) SW2.2
NetDD2_1: DD2.1(RO) SW3.2
NetDD2_2: DD2.2(~{RE}) DD2.3(DE) U4#2.4(2Y)
NetDD2_4: DD2.4(DI) SW4.2
NetDD3_1: DD3.1(RO) SW5.2
NetDD3_2: DD3.2(~{RE}) DD3.3(DE) U4#2.6(3Y)
NetDD3_4: DD3.4(DI) SW6.2
NetDD4_1: DD4.1(RO) SW7.2
NetDD4_2: DD4.2(~{RE}) DD4.3(DE) U4#2.8(4Y)
NetDD4_4: DD4.4(DI) SW8.2
NetHL1_2: HL1.2 R6#2.2
NetHL2_2: HL2.2 R7#2.2
NetHL3_2: HL3.2 R8#2.2
NetHL4_2: HL4.2 R9#2.2
NetHL5_2: HL5.2 R10#2.2
NetHL6_2: HL6.2 R15#2.2
NetHL7_2: HL7.2 R16.2
NetHL8_2: HL8.2 R17.2
NetHL9_2: HL9.2 R18.2
NetHL10_2: HL10.2 R19.2
NetJ1#2_2: J1#2.2 R1#2.1
NetU1#2_6: U1#2.6(LED0) U2#2.3(A)
NetU1#2_7: U1#2.7(LED1) U2#2.6(B)
NetU1#2_8: U1#2.8(LED2) U2#2.14(D)
NetU1#2_9: U1#2.9(LED3) U2#2.10(C)
NetU1#2_10: U1#2.10(LED4) U3#2.6(B)
NetU1#2_11: U1#2.11(LED5) U3#2.3(A)

Not connected (* = marked no-connect by the designer): J2#2 S1(SHIELD) S2(SHIELD); U1#2 12(LED6)* 13(LED7)* 15(LED8)* 16(LED9)* 17(LED10)* 18(LED11)* 19(LED12)* 20(LED13)* 21(LED14)* 22(LED15)*; U3#2 9(EN_C)* 10(C)* 11(G)* 13(H)* 14(D)* 15(EN_D)*; U4#2 10(5Y)* 11(5A)* 12(6Y)* 13(6A)*; U5#2 1(3V3)* 11(GPIO17/GPIO_GEN0)* 12(GPIO18/GPIO_GEN1)* 13(GPIO27/GPIO_GEN2)* 15(GPIO22/GPIO_GEN3)* 16(GPIO23/GPIO_GEN4)* 17(3V3)* 18(GPIO24/GPIO_GEN5)* 19(GPIO10/SPI_MOSI)* 22(GPIO25/GPIO_GEN6)* 23(GPIO11/SPI_SCLK)* 24(GPIO8/~{SPI_CE0})* 31(GPIO6) 37(GPIO26)* 40(GPIO21)* 41(TR01)* 42(TR00)* 43(TR03)* 44(TR02)* S1(SHIELD)* S2(SHIELD)* S3(SHIELD)* S4(SHIELD)*

### Layout directives
differential pair: RS485_2_N, RS485_2_P, RS485_3_N, RS485_3_P, RS485_4_N, RS485_4_P, RS485_N, RS485_P

### Notes on the sheet
- (near J1#2) Кнопка с фиксацией

### Library data of the parts
C1#2 = CMP-2007-00279-2: as C1#1 on sheet list1; Manufacturer Part Number: C0805C104K5RACTU; Device Class L2: Capacitors; Temperature Range Low: -55°C; Voltage Rating: 50 V; Digikey Description: CAP CER 0.1UF 50V X7R 0805; Category: Cap; ComponentLink2Description: Datasheet; Octopart: https://octopart.com/c0805c104k5ractu-kemet-143926; RoHS: TRUE; ComponentLink2URL: https://content.kemet.com/datasheets/KEM_C1003_C0G_SMD.pdf; Temperature Characteristic: X7R; Temperature: -55°C to +125°C; Height: 0.88mm; Temperature Range High: +125°C; Device Class L1: Passive Components; Automotive: No; Lead Free: Yes; Ipc Land Pattern Name: CAPC200125X78; Device Class L3: Ceramic Capacitors; Mouser Description: Cap Ceramic 0.1uF 50V X7R 10% SMD 2.0 x 1.2 mm 125 C Paper T/R; Package: C0805C-DN
C2#2 = CL05B103KA5NNNC: SMD 0402 ; X7R; 0,01 мкФ; 25 В; Manufacturer: SAMSUNG; Persent: ±10%; Type: Ceramic; Part Number: CL05B103KA5NNNC; Package: SMD 0402; Dielectric: X7R; ComponentLink1Description: Datasheet; Value: 100 nF
C3#2 = CL21B106KOQNNNE: SMD 0805; X7R; 10 мкФ; 16 В; Manufacturer: SAMSUNG; Persent: ±15%; Type: Ceramic; Part Number: CL21B106KOQNNNE; Package: SMD 0805; Dielectric: X7R; ComponentLink1Description: Datasheet; Value: 10 мкФ
C4#2 C5#2 C6#2 C7#2 = CL10B152KB8NNNC: SMD 0603 ; X7R; 1,5 нФ; 50 В; Manufacturer: SAMSUNG; Persent: ±15%; Type: Ceramic; Part Number: CL10B152KB8NNNC; Package: SMD 0603; Dielectric: X7R; ComponentLink1Description: Datasheet; Value: 0,1мкФ
D1#2 D2#2 D3#2 D4#2 = Schottky-Diode: ki_description: Schottky Diode; Datasheet: https://diotec.com/de/produktliste/SBD.html; ki_keywords: Schottky
DA1 = LD1117S33TR: Linear regulator, 3V3; Manufacturer: STMicroelectronics; Type: Linear regulator; Part Number: LD1117S33TR
DD1-DD4 = MAX3072E: Half-duplex; Manufacturer: MAXIM; Rate: 3.3v; Notice: True fail-safe; Datasheet: https://static.chipdip.ru/lib/276/DOC000276899.pdf; Shop: https://www.chipdip.ru/product/max3072eesa; Case: soic-8(0.154 inch)
HL1-HL10 = LED: Manufacturer: -; Rate: -; Datasheet: -; Shop: -; Notice: -; Case: -
J1#2 = CMP-15831-000009-1: CONN HEADER VERT 2POS 2.54MM; Manufacturer: Harwin; Conn Gender: Male; Conn Orientation: Vertical; Number Of Contacts: 2; Current Rating: 3A; ComponentLink2URL: https://cdn.harwin.com/pdfs/M20-999.pdf; ComponentLink2Description: Datasheet; Package: M20-9990246; Temperature: -40°C to +105°C; Octopart: https://octopart.com/m20-9990246-harwin-2590635; Mouser Description: 2.54mm (0.1") Pitch SIL Vertical PC Tail Pin Header, 6.1mm mating pin height, tin, 2 contacts; Temperature Range High: +105°C; Device Class L1: Connectors; RoHS: TRUE; Automotive: No; Height: 8.99mm; Number Of Rows: 1; Contact Material: Tin,Nickel; Category: Conn; Pitch: 2.54mm; Lead Free: Yes; Digikey Description: CONN HEADER VERT 2POS 2.54MM; Manufacturer Part Number: M20-9990246; Temperature Range Low: -40°C; Device Class L3: unset; Device Class L2: Headers and Wire Housings
J2#2 = D25S13F6GL00LF: DSUB RASOLDER25SOCKET LF; MF: Amphenol ICC (FCI); MP: D25S13F6GL00LF; Price: None; Availability: In Stock; Package: None; SnapEDA_Link: https://www.snapeda.com/parts/D25S13F6GL00LF/Amphenol+FCI/view-part/?ref=snap; Purchase-URL: https://pricing.snapeda.com/search/part/D25S13F6GL00LF/?ref=eda; Value: *; Check_prices: https://www.snapeda.com/parts/D25S13F6GL00LF/Amphenol+FCI/view-part/?ref=eda
P1 = CMP-1502-01058-3: NexarPartId: 32855518; Current Rating: 3A; Connector Type: Male Pin; Number of Positions: 1; Contact Resistance: 20mΩ; Gender: Male; Operating Supply Voltage: 250V; Orientation: Vertical; Contact Mating Length: 5.9944mm; Termination: Solder; Number of Rows: 1; Number of Pins: 1; Mount: Through Hole; RoHS: Compliant; Contact Material: Copper; Color: Black; Lead Pitch: 2.54mm; Number of Contacts: 1; Contact Plating: Gold; Packaging: Bulk; REACH SVHC: Unknown
R1#2 R2#2 = CMP-2001-04375-5: Chip Resistor, 100 Ohm, +/- 1%, 0.125 W, -55 to 155 degC, 0805 (2012 Metric), RoHS, Tape and Reel; Manufacturer: Panasonic; ComponentLink1URL: http://www.panasonic.com/; ComponentLink2Description: Datasheet; REACH SVHC: Yes; ComponentLink1Description: Manufacturer URL; Length: 2 mm; Height: 0.6 mm; Package Quantity: 1; PackageDescription: 2-Pin Surface Mount Device, Body 2 x 1.25 mm; Packaging: Cut Tape; PackageReference: 0805; Max Operating Temperature: 155 degC; Mounting Technology: Surface Mount; ComponentLink2URL: http://industrial.panasonic.com/cdbs/www-data/pdf/RDA0000/AOA0000C86.pdf; DatasheetVersion: 04/2015; Min Operating Temperature: -55 degC; RoHSCompliant: true; Mount: Surface Mount
R3#2 R4#2 R11#2 R12#2 = RC0603FR-0722KL: SMD 0603; 0,1; 1%; 22 кОм; Manufacturer: Yageo; Power: 0,1; TCR: 200 ppm; Part Number: RC0603FR-0722KL; Package: SMD 0603; Persent: 1%; Category: R; Value: 22 к
R5#2 R13#2 R14#2 R20 = RC0603FR-07120RL: SMD 0603; 0,1; 1%; 120 Ом; Manufacturer: Yageo; Power: 0,1; TCR: 200 ppm; Part Number: RC0603FR-07120RL; Package: SMD 0603; Persent: 1%; Value: 120; Category: R
U1#2 = PCA9685PW,118: LED Driver IC 16 Output Linear - PWM Dimming 25mA 28-TSSOP; MF: NXP USA; Value: *; MP: PCA9685PW,118; Purchase-URL: https://pricing.snapeda.com/search/part/PCA9685PW,118/?ref=eda; Availability: In Stock; Price: None; Package: TSSOP-28 NXP Semiconductors
U2#2 U3#2 = CD40109BE: Ð§ÐµÑ‚Ñ‹Ñ€ÐµÑ…ÑŠÑÐ´ÐµÑ€Ð½Ñ‹Ð¹ ÐšÐœÐžÐŸ-Ð¿Ñ€ÐµÐ¾Ð±Ñ€Ð°Ð·Ð¾Ð²Ð°Ñ‚ÐµÐ»ÑŒ Ð½Ð¸Ð·ÐºÐ¾Ð³Ð¾ Ð½Ð°Ð¿Ñ€ÑÐ¶ÐµÐ½Ð¸Ñ Ð² Ð²Ñ‹ÑÐ¾ÐºÐ¾Ðµ (Ð½Ð¾Ð¼Ð¸Ð½Ð°Ð»ÑŒÐ½Ð¾Ðµ Ð½Ð°Ð¿Ñ€ÑÐ¶ÐµÐ½Ð¸Ðµ 20 Ð’); MF: Texas Instruments; SnapEDA_Link: https://www.snapeda.com/parts/CD40109BE/Texas+Instruments/view-part/?ref=snap; Package: PDIP-16 Texas Instruments; Value: *; MP: CD40109BE; Check_prices: https://www.snapeda.com/parts/CD40109BE/Texas+Instruments/view-part/?ref=eda
U4#2 = 74HC14D: Inverter IC 6 Channel Schmitt Trigger 14-SOIC; MF: Toshiba; SnapEDA_Link: https://www.snapeda.com/parts/74HC14D/Toshiba+Semiconductor+and+Storage/view-part/?ref=snap; Availability: In Stock; Price: None; Package: SO14-14 Nexperia USA Inc.; Purchase-URL: https://pricing.snapeda.com/search/part/74HC14D/?ref=eda; Check_prices: https://www.snapeda.com/parts/74HC14D/Toshiba+Semiconductor+and+Storage/view-part/?ref=eda; Value: *; MP: 74HC14D
U5#2 = RASPBERRY_PI_4B_4GB: BCM2711 Raspberry Pi 4 Model B 4GB - ARMÂ® CortexÂ®-A72 MPU Embedded Evaluation Board; MP: RASPBERRY PI 4B/4GB; Price: None; MF: Raspberry Pi; Check_prices: https://www.snapeda.com/parts/RASPBERRY%20PI%204B/4GB/Raspberry+Pi/view-part/?ref=eda; Value: *; Purchase-URL: https://pricing.snapeda.com/search/part/RASPBERRY PI 4B/4GB/?ref=eda; Availability: In Stock; SnapEDA_Link: https://www.snapeda.com/parts/RASPBERRY%20PI%204B/4GB/Raspberry+Pi/view-part/?ref=snap; Package: None
XP1 = XT30PW-M: Manufacturer: AMASS; Type: XT; Part Number: XT30PW-M

## Nets that join several sheets
3.3v: list1 (19 pins), Main (8 pins)
5v: list1 (10 pins), Main (11 pins)
GND: list1 (44 pins), Main (43 pins)